# EAGLE design Ultrafin(43)v6_finfix (EAGLE 7.4.0)
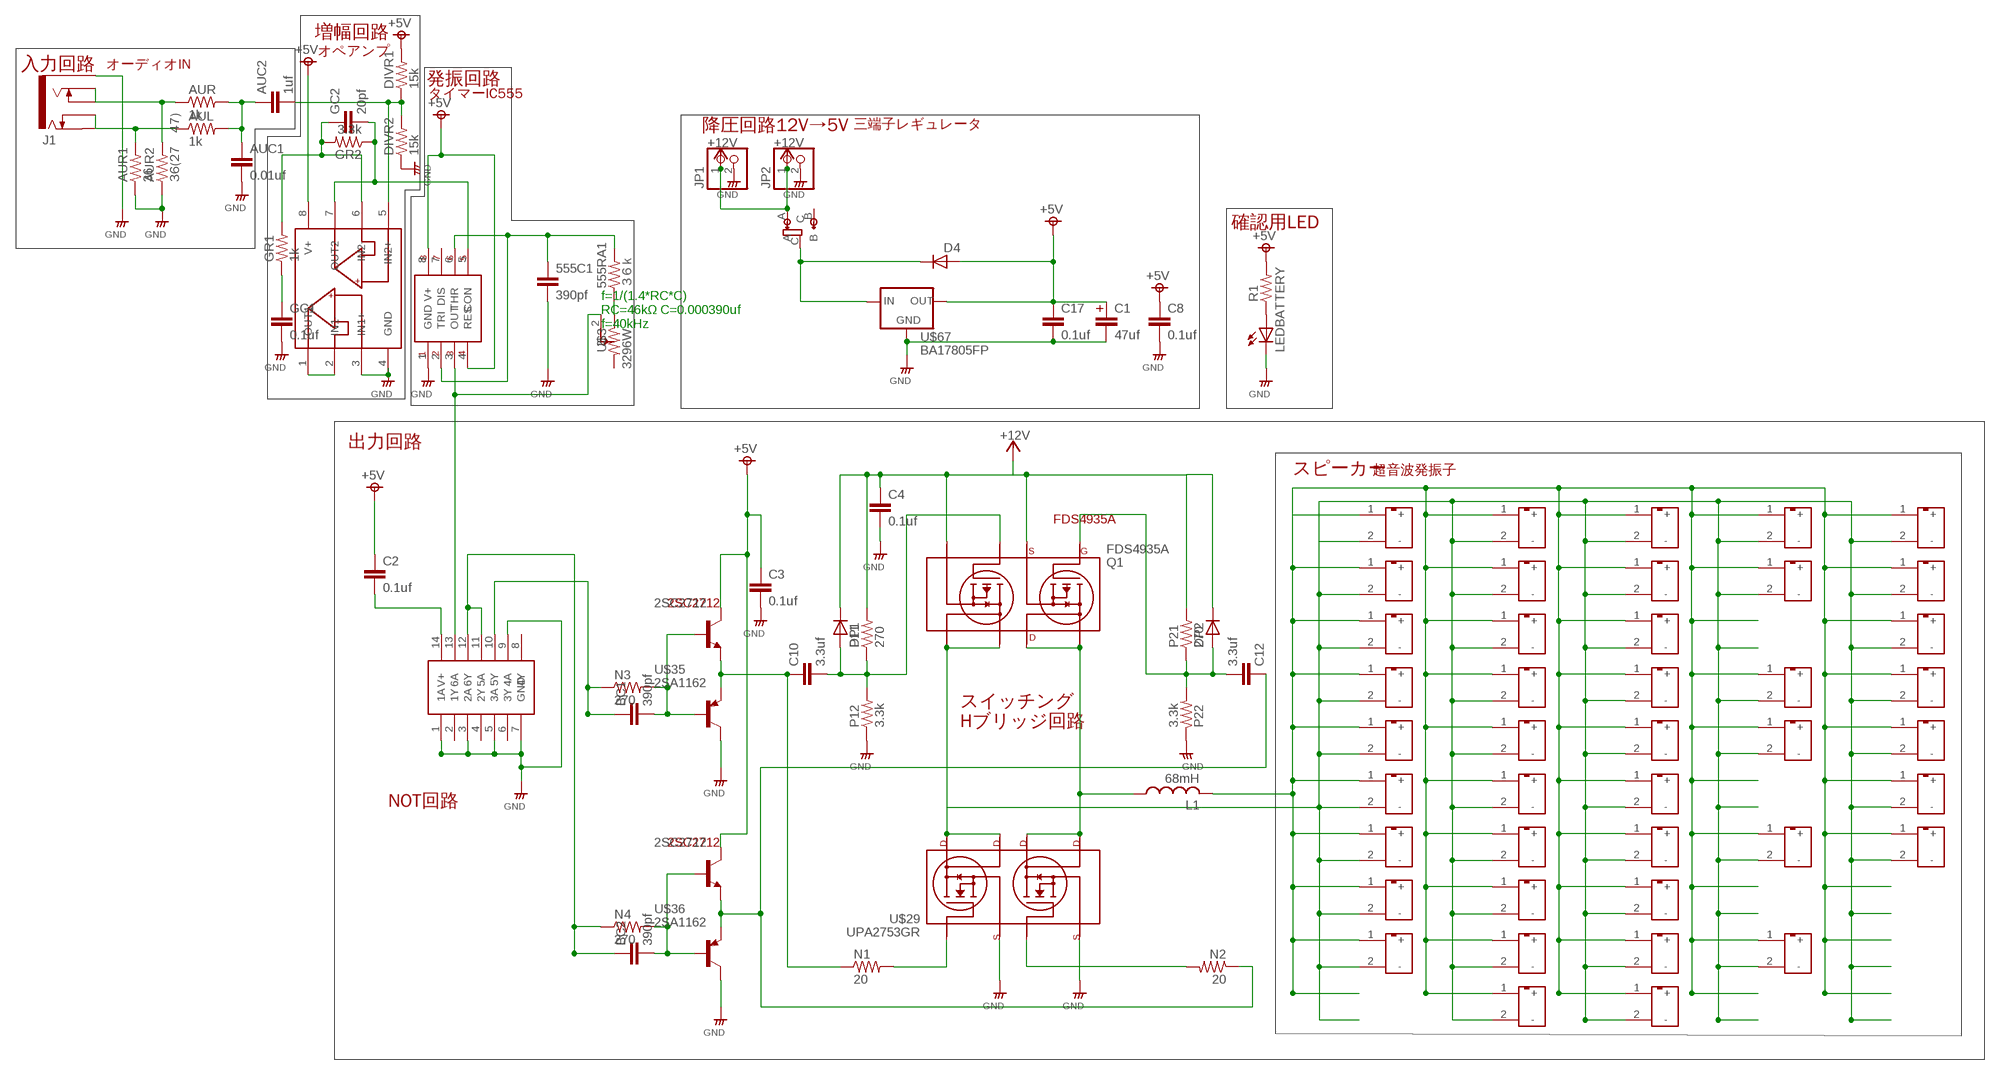
[diagram p0: schematic, sheet 1]

## Parts
555C1  390pf  MLCC  [1608]
555RA1  ３6ｋ  RESISTORS-3  [R_0.3]
AUC1  0.01uf  MLCC  [1608]
AUC2  1uf  MLCC  [1608]
AUL  1k  RESISTORS  [3225]
AUR  1k  RESISTORS  [3225]
AUR1  36  RESISTORS-3  [R_0.3]
AUR2  36(27 47)  RESISTORS1608  [1608]
BC1  390pf  MLCC-3  [MLCC_50]
BC2  390pf  MLCC  [1608]
C1  47uf  CAPACITOR-1U  [C_1U]
C2  0.1uf  MLCC  [1608]
C3  0.1uf  MLCC  [1608]
C4  0.1uf  MLCC  [1608]
C8  0.1uf  MLCC  [1608]
C10  3.3uf  MLCC-3  [MLCC_50]
C12  3.3uf  MLCC-3  [MLCC_50]
C17  0.1uf  MLCC  [1608]
D4  DIODE_JISSO2  [DIODE_JISSO2]
DIVR1  15k  RESISTORS-3  [R_0.3]
DIVR2  15k  RESISTORS-3  [R_0.3]
DP1  DIODE_3  [DIODE_3]
DP2  DIODE_3  [DIODE_3]
GC1  0.1uf  MLCC  [1608]
GC2  20pf  MLCC  [1608]
GR1  1k  RESISTORS  [3225]
GR2  3.3k  RESISTORS-3  [R_0.3]
J1  MJ-352W-C  [MJ-352-M-C]
JP1  PINHD-1X2"  [1*02]
JP2  PINHD-1X2"  [1*02]
L1  68mH  LHL10NB104J  [LHL10NB104J]
LEDBATTERY  LED3MM  [LED3MM]
N1  20  RESISTORS1608  [1608]
N2  20  RESISTORS-3  [R_0.3]
N3  270  RESISTORS1608  [1608]
N4  270  RESISTORS1608  [1608]
P11  270  RESISTORS-3  [R_0.3]
P12  3.3k  RESISTORS-3  [R_0.3]
P21  270  RESISTORS-3  [R_0.3]
P22  3.3k  RESISTORS-3  [R_0.3]
Q1  FDS4935A  [FDS4935A]
R1  RESISTORS3216  [3216]
U$3  3296W  [R_VARIABLE]
U$4  UT1007-Z325R  [UT1007-Z325R]
U$5  ICM7555CD  [SOP8]
U$8  UT1007-Z325R  [UT1007-Z325R]
U$10  UT1007-Z325R  [UT1007-Z325R]
U$11  UT1007-Z325R  [UT1007-Z325R]
U$12  UT1007-Z325R  [UT1007-Z325R]
U$14  74HC04NS  [SOP14]
U$16  BF2904F  [SOP8]
U$18  UT1007-Z325R  [UT1007-Z325R]
U$23  UT1007-Z325R  [UT1007-Z325R]
U$25  UT1007-Z325R  [UT1007-Z325R]
U$27  UT1007-Z325R  [UT1007-Z325R]
U$28  UT1007-Z325R  [UT1007-Z325R]
U$29  UPA2753GR  [UPA2753GR]
U$31  UT1007-Z325R  [UT1007-Z325R]
U$35  2SA1162  [2SA1162]
U$36  2SA1162  [2SA1162]
U$37  2SC2712  [2SC2712]
U$38  2SC2712  [2SC2712]
U$39  UT1007-Z325R  [UT1007-Z325R]
U$40  UT1007-Z325R  [UT1007-Z325R]
U$42  UT1007-Z325R  [UT1007-Z325R]
U$45  UT1007-Z325R  [UT1007-Z325R]
U$46  UT1007-Z325R  [UT1007-Z325R]
U$47  UT1007-Z325R  [UT1007-Z325R]
U$48  UT1007-Z325R  [UT1007-Z325R]
U$49  UT1007-Z325R  [UT1007-Z325R]
U$50  UT1007-Z325R  [UT1007-Z325R]
U$51  UT1007-Z325R  [UT1007-Z325R]
U$52  UT1007-Z325R  [UT1007-Z325R]
U$53  UT1007-Z325R  [UT1007-Z325R]
U$54  UT1007-Z325R  [UT1007-Z325R]
U$55  UT1007-Z325R  [UT1007-Z325R]
U$56  UT1007-Z325R  [UT1007-Z325R]
U$57  UT1007-Z325R  [UT1007-Z325R]
U$58  UT1007-Z325R  [UT1007-Z325R]
U$59  UT1007-Z325R  [UT1007-Z325R]
U$60  UT1007-Z325R  [UT1007-Z325R]
U$61  UT1007-Z325R  [UT1007-Z325R]
U$62  UT1007-Z325R  [UT1007-Z325R]
U$63  UT1007-Z325R  [UT1007-Z325R]
U$64  UT1007-Z325R  [UT1007-Z325R]
U$67  BA17805FP  [BA17805FP]
U$71  UT1007-Z325R  [UT1007-Z325R]
U$74  UT1007-Z325R  [UT1007-Z325R]
U$78  UT1007-Z325R  [UT1007-Z325R]
U$79  UT1007-Z325R  [UT1007-Z325R]
U$80  UT1007-Z325R  [UT1007-Z325R]
U$81  UT1007-Z325R  [UT1007-Z325R]
U$82  UT1007-Z325R  [UT1007-Z325R]
U$83  UT1007-Z325R  [UT1007-Z325R]
U$84  SLIDE_ESD175202  [SLIDE_ESD175202]

## Nets
+5V: C1.P$1 C2.P$1 C3.P$1 C8.P$1 C17.P$1 D4.P$1(A) DIVR1.2 R1.P$6 U$5.4(RES) U$5.8(V+) U$16.8(V+) U$37.C U$38.C U$67.OUTPUT(OUT)
+12V: C4.P$1 DP1.C DP2.C JP1.1 JP2.1 P11.2 P21.2 Q1.1(S2) Q1.3(S1) U$84.A
AGND: 555C1.P$2 AUC1.P$2 AUR1.1 AUR2.P$1 C1.P$2 C8.P$2 C17.P$2 DIVR2.1 GC1.P$2 J1.1 JP1.2 JP2.2 LEDBATTERY.K(C) P12.1 P22.1 U$5.1(GND) U$14.1(1A) U$14.3(2A) U$14.5(3A) U$14.7(GND) U$14.9(4A) U$16.3(IN1+) U$16.4(GND) U$29.1(S1) U$29.3(S2) U$35.C U$36.C U$67.COMMON(GND) ; supply symbol labelled GND
GND: C3.P$2 C4.P$2
N$1: AUR2.P$2 AUR.P$1 J1.2 J1.3
N$2: AUL.P$1 AUR1.2 J1.4 J1.5
N$3: AUC1.P$1 AUC2.P$1 AUL.P$2 AUR.P$2
N$4: C12.1 N2.1 U$36.E U$38.E
N$5: BC2.P$1 N4.P$1 U$14.11(5A) U$14.12(6Y)
N$6: Q1.7(D22) Q1.8(D21) U$4.2(-) U$8.2(-) U$10.2(-) U$11.2(-) U$12.2(-) U$18.2(-) U$23.2(-) U$25.2(-) U$27.2(-) U$28.2(-) U$29.7(D12) U$29.8(D11) U$31.2(-) U$39.2(-) U$40.2(-) U$42.2(-) U$45.2(-) U$46.2(-) U$47.2(-) U$48.2(-) U$49.2(-) U$50.2(-) U$51.2(-) U$52.2(-) U$53.2(-) U$54.2(-) U$55.2(-) U$56.2(-) U$57.2(-) U$58.2(-) U$59.2(-) U$60.2(-) U$61.2(-) U$62.2(-) U$63.2(-) U$64.2(-) U$71.2(-) U$74.2(-) U$78.2(-) U$79.2(-) U$80.2(-) U$81.2(-) U$82.2(-) U$83.2(-)
N$7: 555C1.P$1 555RA1.2 U$5.2(TRI) U$5.6(THR)
N$8: U$3.2 U$5.3(OUT) U$14.13(6A)
N$9: 555RA1.1 U$3.1
N$10: L1.1 Q1.5(D12) Q1.6(D11) U$29.5(D22) U$29.6(D21)
N$11: C10.1 N1.P$1 U$35.E U$37.E
N$12: C10.2 DP1.A P11.1 P12.2 Q1.2(G2)
N$16: BC1.2 N3.P$2 U$35.B U$37.B
N$18: BC2.P$2 N4.P$2 U$36.B U$38.B
N$20: BC1.1 N3.P$1 U$14.10(5Y)
N$21: N1.P$2 U$29.2(G1)
N$22: AUC2.P$2 DIVR1.1 DIVR2.2 U$16.5(IN2+)
N$24: GC2.P$1 GR1.P$2 GR2.2 U$16.6(IN2-)
N$25: GC1.P$1 GR1.P$1
N$26: C12.2 DP2.A P21.1 P22.2 Q1.4(G1)
N$28: N2.2 U$29.4(G2)
N$29: D4.P$2(C) U$67.INPUT(IN) U$84.C
N$30: U$16.1(OUT1) U$16.2(IN1-)
N$39: GC2.P$2 GR2.1 U$5.5(CON) U$16.7(OUT2)
N$40: LEDBATTERY.A R1.P$5
N$41: L1.2 U$4.1(+) U$8.1(+) U$10.1(+) U$11.1(+) U$12.1(+) U$18.1(+) U$23.1(+) U$25.1(+) U$27.1(+) U$28.1(+) U$31.1(+) U$39.1(+) U$40.1(+) U$42.1(+) U$45.1(+) U$46.1(+) U$47.1(+) U$48.1(+) U$49.1(+) U$50.1(+) U$51.1(+) U$52.1(+) U$53.1(+) U$54.1(+) U$55.1(+) U$56.1(+) U$57.1(+) U$58.1(+) U$59.1(+) U$60.1(+) U$61.1(+) U$62.1(+) U$63.1(+) U$64.1(+) U$71.1(+) U$74.1(+) U$78.1(+) U$79.1(+) U$80.1(+) U$81.1(+) U$82.1(+) U$83.1(+)
N$43: C2.P$2 U$14.14(V+)
Unconnected: U$3.3 U$5.7(DIS) U$14.2(1Y) U$14.4(2Y) U$14.6(3Y) U$14.8(4Y) U$84.B

## Notes on the sheet
- 増幅回路
- オペアンプ
- 入力回路 | オーディオIN
- 発振回路
- タイマーIC555
- 降圧回路12V→5V | 三端子レギュレータ
- 確認用LED
- f=1/(1.4*RC*C)
  RC=46kΩ C=0.000390uf
  f=40kHz
- 出力回路
- スピーカー | 超音波発振子
- スイッチング
  Hブリッジ回路
- NOT回路

## Library data of the parts
555C1 AUC1 AUC2 BC1 BC2 C2-C4 C8 C10 C12 C17 GC1 GC2 = rcl__s:MLCC: CAPACITOR, European symbol
555RA1 AUL AUR AUR1 AUR2 DIVR1 DIVR2 GR1 GR2 N1-N4 P11 P12 P21 P22 R1 = rcl__s:RESISTORS
C1 = rcl__s:CAPACITOR
D4 DP1 DP2 = diode_s:DIODE
J1 = demi:MJ-352W-C: MJ-352W-C Marushin 3.5mm Stereo Jack
JP1 JP2 = pinhead_s:PINHD-1X2: PIN HEADER
L1 = Coil:LHL10NB104J
LEDBATTERY = LED_s:LED: LED OSRAM: - CHIPLED LG R971, LG N971, LY N971, LG Q971, LY Q971, LO R971, LY R971 LH N974, LH R974 LS Q976, LO Q976, LY Q976 LO Q996 - Hyper CHIPLED LW Q18S LB Q993, LB Q99A, LB R99A - SideLED LS A670, LO A670, LY A670, LG A670, LP A670 LB A673, LV A673, LT A673, LW A673 LH A674 LY A675 LS A676, LA A676, LO A676, LY A676, LW A676 LS A679, LY A679, LG A679 - Hyper Micro SIDELED® LS Y876, LA Y876, LO Y876, LY Y876 LT Y87S - SmartLED LW L88C, LW L88S LB L89C, LB L89S, LG L890 LS L89K, LO L89K, LY L89K LS L896, LA L896, LO L896, LY L896 - TOPLED LS T670, LO T670, LY T670, LG T670, LP T670 LSG T670, LSP T670, LSY T670, LOP T670, LYG T670 LG T671, LOG T671, LSG T671 LB T673, LV T673, LT T673, LW T673 LH T674 LS T676, LA T676, LO T676, LY T676, LB T676, LH T676, LSB T676, LW T676 LB T67C, LV T67C, LT T67C, LS T67K, LO T67K, LY T67K, LW E67C LS E67B, LA E67B, LO E67B, LY E67B, LB E67C, LV E67C, LT E67C LW T67C LS T679, LY T679, LG T679 LS T770, LO T770, LY T770, LG T770, LP T770 LB T773, LV T773, LT T773, LW T773 LH T774 LS E675, LA E675, LY E675, LS T675 LS T776, LA T776, LO T776, LY T776, LB T776 LHGB T686 LT T68C, LB T68C - Hyper Mini TOPLED® LB M676 - Mini TOPLED Santana® LG M470 LS M47K, LO M47K, LY M47K Source: http://www.osram.convergy.de - LUMILED® LXK2-PW12-R00, LXK2-PW12-S00, LXK2-PW14-U00, LXK2-PW14-V00 LXK2-PM12-R00, LXK2-PM12-S00, LXK2-PM14-U00 LXK2-PE12-Q00, LXK2-PE12-R00, LXK2-PE12-S00, LXK2-PE14-T00, LXK2-PE14-U00 LXK2-PB12-K00, LXK2-PB12-L00, LXK2-PB12-M00, LXK2-PB14-N00, LXK2-PB14-P00, LXK2-PB14-Q00 LXK2-PR12-L00, LXK2-PR12-M00, LXK2-PR14-Q00, LXK2-PR14-R00 LXK2-PD12-Q00, LXK2-PD12-R00, LXK2-PD12-S00 LXK2-PH12-R00, LXK2-PH12-S00 LXK2-PL12-P00, LXK2-PL12-Q00, LXK2-PL12-R00 Source: www.luxeon.com
Q1 = FET_s:FDS4935A
U$3 = rcl__s:3296W
U$4 U$8 U$10-U$12 U$18 U$23 U$25 U$27 U$28 U$31 U$39 U$40 U$42 U$45-U$64 U$71 U$74 U$78-U$83 = UT1007-Z325R:UT1007-Z325R
U$5 = LMC555:ICM7555CD
U$14 = 74HCserias:74HC04NS
U$16 = OP_s:BF2904F
U$29 = FET_s:UPA2753GR
U$35 U$36 = demi:2SA1162
U$37 U$38 = demi:2SC2712
U$67 = regulator_s:BA17805FP
U$84 = switch_s:SLIDE_ESD175202

## Board
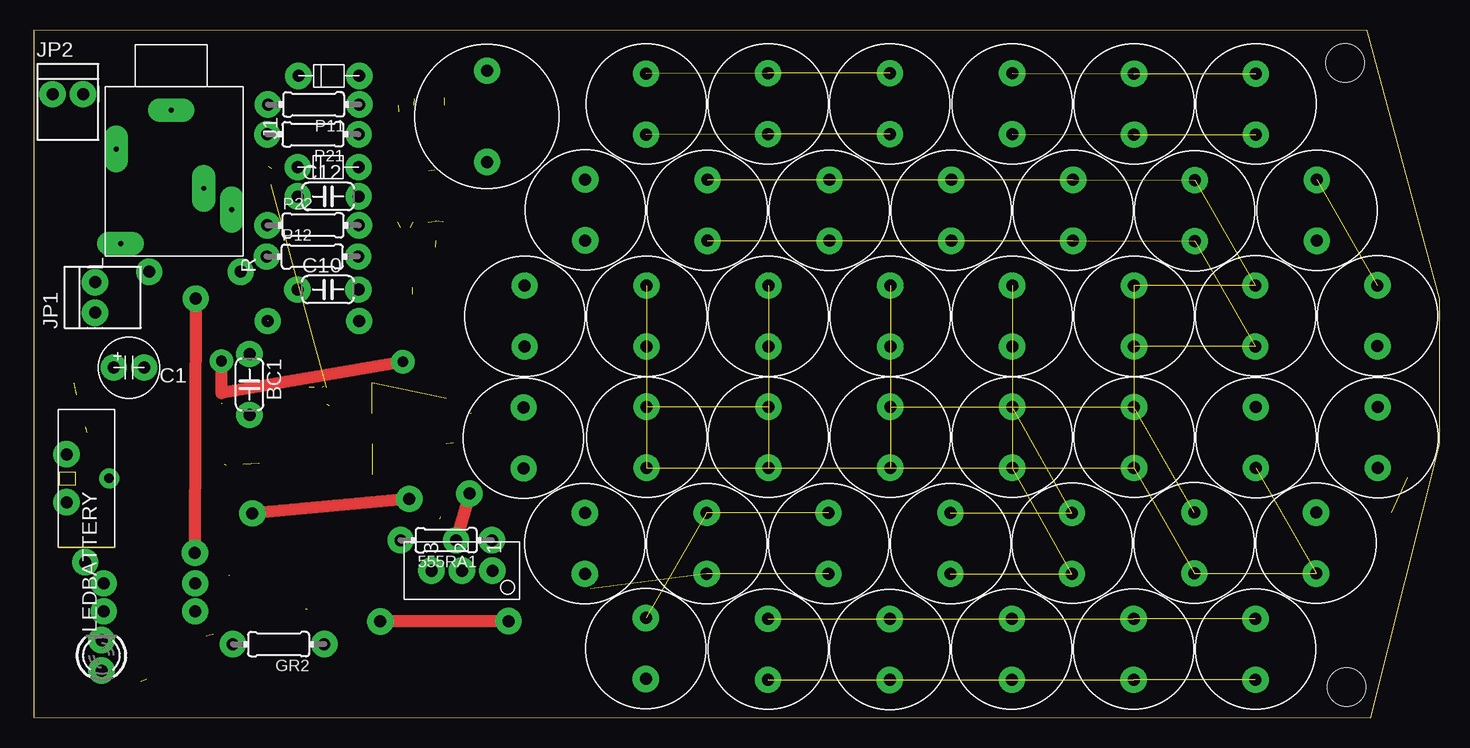
[diagram p1: board, top side]
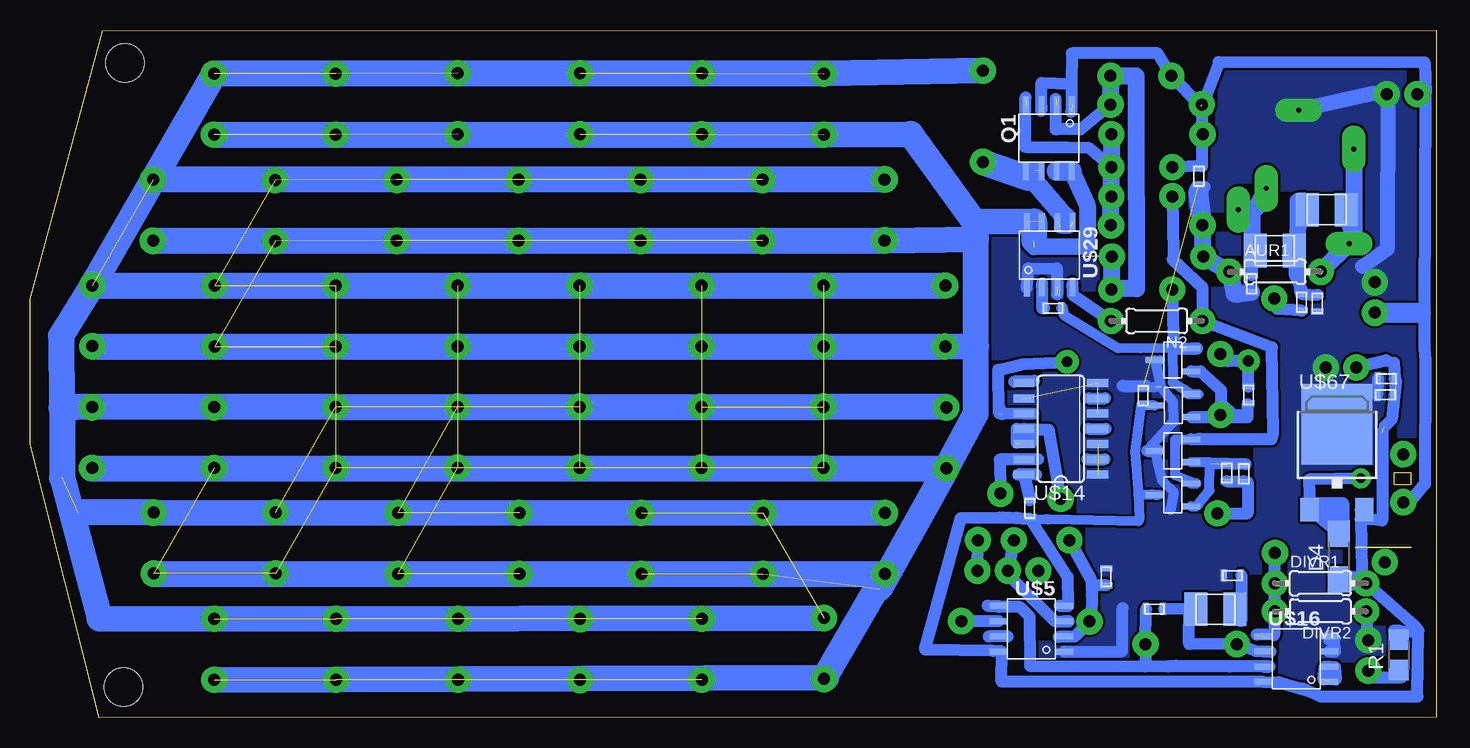
[diagram p2: board, bottom side, seen from below]

Size 117.24 x 57.36 mm. Coordinates in mm from the lower left corner, seen from the top.
Outline: 0,0.03 111.47,0 117.24,22.83 117.22,34.94 111.17,57.31 0,57.36 0,0.03
Copper layers (1*16): Top 0.035mm / dielectric 1.5mm / Bottom 0.035mm
Design rules "default": minimum track width 10mil, minimum drill 24mil, track to track 8mil, track to pad 8mil, pad to pad 8mil, via to via 8mil, smd to smd 8mil, copper to edge 40mil, drill to drill 8mil, minimum pad ring 10mil, minimum via ring 8mil, stop-mask expansion 4mil, vias tented up to drill 0mil, thermal gap 10mil
Holes 3.2 mm at 109.46,2.57 109.33,54.61

### Footprints (pad centres in the part's own frame; a part is rotated, then mirrored left to right if it is on the bottom)
1608 = smd 0.5 x 1: P$1 -0.7,0; P$2 0.7,0
R_0.3 = drill 1 pad 2.184: 1 -3.81,0; 2 3.81,0; 3 -3.81,0
3225 = smd 1.9 x 2.8: P$1 -1.27,0.02; P$2 1.98,0.02
MLCC_50 = drill 1 pad 2.184: 1 -2.54,0; 2 2.54,0
C_1U = drill 1 pad 2.184: P$1 -1.27,0; P$2 1.27,0
DIODE_JISSO2 = smd 2.184 x 1.829: P$1 -1.905,0; P$2 1.905,0
DIODE_3 = drill 1 pad 2.184: A -2.54,0; C 2.54,0
MJ-352-M-C = drill 0.4 pad 1.95 long: 1 -4.655,-1.99; 2 3.645,3.05; 3 1.875,0.72; 4 6.475,-6.2; 5 -1.405,-6.58
1*02 = drill 1 pad 2.184: 1 -1.27,0; 2 1.27,0
LHL10NB104J = drill 1 pad 2.184: 1 0,3.81; 2 0,-3.81
LED3MM = drill 1 pad 2.184: A -1.27,0; K 1.27,0
FDS4935A = smd 1.5 x 0.5: 1 -2.74,1.905; 2 -2.74,0.635; 3 -2.74,-0.635; 4 -2.74,-1.905; 5 2.74,-1.905; 6 2.74,-0.635; 7 2.74,0.635; 8 2.74,1.905
3216 = smd 1.676 x 1.676: P$5 0,0; P$6 2.54,0
R_VARIABLE = drill 1 pad 2.184: 1 0.019,-2.578; 2 0.019,-0.037; 3 0.019,2.502
UT1007-Z325R = drill 1 pad 2.184: 1 0,2.54; 2 0,-2.54
SOP8 = smd 1.5 x 0.5: 1 -2.74,1.905; 2 -2.74,0.635; 3 -2.74,-0.635; 4 -2.74,-1.905; 5 2.74,-1.905; 6 2.74,-0.635; 7 2.74,0.635; 8 2.74,1.905
SOP14 = smd 0.66 x 1.778: 1 -3.81,-3.073; 2 -2.54,-3.073; 3 -1.27,-3.073; 4 0,-3.073; 5 1.27,-3.073; 6 2.54,-3.073; 7 3.81,-3.073; 8 3.81,3.073; 9 2.54,3.073; 10 1.27,3.073; 11 0,3.073; 12 -1.27,3.073; 13 -2.54,3.073; 14 -3.81,3.073
UPA2753GR = smd 1.5 x 0.5: 1 -2.74,1.905; 2 -2.74,0.635; 3 -2.74,-0.635; 4 -2.74,-1.905; 5 2.74,-1.905; 6 2.74,-0.635; 7 2.74,0.635; 8 2.74,1.905
2SA1162 = smd 1.524 x 0.508: B -1.459,0.767; C 1.594,-0.182; E -1.459,-1.133
2SC2712 = smd 1.524 x 0.508: B -1.696,0.95; C 1.356,0; E -1.696,-0.95
BA17805FP = smd 5.908 x 6.708: COMMON 0,1.547 | smd 1.508 x 1.93: INPUT -2.28,-5.594; OUTPUT 2.28,-5.594
SLIDE_ESD175202 = drill 1 pad 2.184: A -0.031,-7.735; B -0.031,-3.735; S2 1.531,-12.735 | drill 0.8 pad 1.676: C 3.519,-5.747

### Placement (x,y rotation side)
555C1  27.53,11.75 90 bottom
555RA1  34.4,14.81 180 top
AUC1  9.92,34.58 270 bottom
AUC2  11.22,34.66 270 bottom
AUL  8.78,42.39 180 bottom
AUR  13.83,38.94 0 bottom
AUR1  13.45,37.2 0 bottom
AUR2  15.4,36.2 90 bottom
BC1  18,27.8 270 top
BC2  17.47,20.42 90 bottom
C1  7.95,29.21 0 top
C2  33.89,17.46 90 bottom
C3  24.43,26.86 90 bottom
C4  19.8,45.15 270 bottom
C8  4.18,28.29 180 bottom
C10  24.54,35.72 0 top
C12  24.56,43.48 0 top
C17  4.24,26.94 180 bottom
D4  8.14,13.46 90 bottom
DIVR1  9.67,11.22 0 bottom
DIVR2  9.67,8.87 180 bottom
DP1  24.62,53.53 180 top
DP2  24.56,45.93 180 top
GC1  17,11.87 180 bottom
GC2  23.51,9.08 180 bottom
GR1  18.08,9.08 180 bottom
GR2  20.43,6.14 180 top
J1  13.46,46.02 270 top
JP1  5.13,35.05 90 top
JP2  2.86,52.01 0 top
L1  37.8,50.16 180 top
LEDBATTERY  5.67,5.21 90 top
N1  31.98,34.15 180 bottom
N2  23.32,33.1 180 bottom
N3  15.67,26.92 270 bottom
N4  16.05,20.35 90 bottom
P11  23.35,51.15 180 top
P12  23.24,38.47 0 top
P21  23.29,48.66 180 top
P22  23.3,41.07 0 top
Q1  32.31,48.34 270 bottom
R1  3.14,3.98 90 bottom
U$3  35.67,12.26 90 top
U$4  91.74,33.5 0 top
U$5  33.77,7.41 180 bottom
U$8  101.9,51.18 0 top
U$10  91.74,51.18 0 top
U$11  81.58,51.21 0 top
U$12  71.39,51.21 0 top
U$14  31.31,24.1 90 bottom
U$16  11.67,4.91 180 bottom
U$18  61.23,51.21 0 top
U$23  51.07,51.18 0 top
U$25  86.66,42.32 0 top
U$27  91.74,23.38 0 top
U$28  86.57,14.56 0 top
U$29  32.24,38.61 90 bottom
U$31  71.37,5.7 0 top
U$35  21.89,29.65 180 bottom
U$36  21.89,22.08 180 bottom
U$37  22.11,26.04 180 bottom
U$38  22.13,18.59 180 bottom
U$39  96.81,42.29 0 top
U$40  61.23,5.71 0 top
U$42  45.99,42.35 0 top
U$45  96.76,14.59 0 top
U$46  81.55,5.71 0 top
U$47  91.71,5.71 0 top
U$48  101.87,5.71 0 top
U$49  101.9,23.37 0 top
U$50  76.44,14.54 0 top
U$51  66.28,14.54 0 top
U$52  56.12,14.54 0 top
U$53  45.96,14.54 0 top
U$54  40.85,23.34 0 top
U$55  61.26,33.5 0 top
U$56  71.42,33.5 0 top
U$57  81.58,33.5 0 top
U$58  51.1,23.4 0 top
U$59  40.94,33.5 0 top
U$60  51.1,33.5 0 top
U$61  61.26,23.4 0 top
U$62  71.42,23.4 0 top
U$63  81.58,23.4 0 top
U$64  76.5,42.32 0 top
U$67  8.29,22.96 0 bottom
U$71  101.85,33.51 0 top
U$74  51.04,5.78 0 top
U$78  66.34,42.32 0 top
U$79  56.18,42.32 0 top
U$80  106.98,42.32 0 top
U$81  112.06,23.37 0 top
U$82  106.92,14.57 0 top
U$83  112.03,33.53 0 top
U$84  2.78,25.72 0 top

### Tracks (layer width: path | path; a pad name or v marks a point on that pad's centre or on a via)
+5V  (4 unrouted)
  Bottom 0.813: U$37.C 24.62,26.07 25.13,22.19 24.86,18.63 | U$38.C 23.13,18.59 23.13,18.61 24.86,18.63 | 24.86,18.63 23.71,18.64 24.84,18.58 24.75,16.61 24.81,16.51 24.81,16.38 32.37,16.54 32.4,16.55 32.51,16.55 33.53,16.52
  Bottom 1.016: 4.49,23.81 4.52,16.45 6.3,16.57 | 33.53,16.52 36.19,16.71 | 36.19,16.71 35.05,16.68 39.64,16.64 42.62,5.68 36.96,5.57 36.22,5.55 | U$5.8 36.22,5.55 | 36.22,5.55 36.24,3.02 14.88,3.02 U$16.8 13.1,2.98 10.81,2.29 | 10.81,2.29 11.19,2.45 | U$5.4 31.42,9.35 31.04,9.34 30.69,9.34 30.69,9.37 30.72,11.8 30.75,11.78 33.86,16.59 36.43,16.71 36.19,16.71 | 10.81,2.29 9.64,1.78 1.57,1.78 1.51,7.18 | 5.88,11.16 DIVR1.2 | 1.51,7.18 1.48,7.27 1.79,7.65 DIVR1.2 | R1.P$6 3.1,7.27 3.51,7.27 1.51,7.18 | 4.33,24.26 3.73,24.86 3.38,28.01 3.35,27.94 3.37,28.1 C8.P$1 3.54,29.59 4.18,29.81 C1.P$1 | U$67.OUTPUT 6.3,17.36 6.3,16.57 | 6.3,16.57 6.21,12.16 DIVR1.2 | 6.14,11.37 DIVR1.2
  Bottom 1.676: D4.P$1 6.14,11.37
+12V  (3 unrouted)
  Bottom 1.016: 2.75,18.1 U$84.A 2.21,17.98 0.95,19.49 0.94,19.49 0.97,19.53 0.91,29.5 | 30.42,52.89 30.4,55.4 23.23,55.4 DP1.C 19.57,51.02 19.57,50.99 19.42,51.25 18.15,54.64 18.15,54.67 0.97,54.64 0.87,52.13 | 30.42,52.89 30.43,50.55 | Q1.3 32.94,50.61 32.91,52.96 30.42,52.89 | 0.96,33.77 0.97,30.61 0.91,29.5 | 0.96,33.77 0.87,52.13 | DP2.C 19.54,45.99 P11.2 19.54,49.15 19.48,49.09 P21.2 | 0.94,30.13 0.91,29.5 | 0.87,52.13 JP2.1 | JP1.1 0.96,33.77
AGND  (6 unrouted)
  Bottom 0.813: 23.03,29.81 U$35.C 22.97,27.59 21.96,26.32 21.92,24.67 24.02,22.38 U$36.C 22.88,19.78 21.89,18.86 22.18,17.3 | 24.05,27.59 23.38,27.59
  Bottom 1.016: U$5.1 26.18,5.56 26.16,9.14 | LEDBATTERY.K DIVR2.1 | C8.P$2 C17.P$2 | U$16.3 8.46,5.54 8.46,5.81 8.49,5.81 8.49,6.54 8.93,6.54 U$16.4 | 26.15,27.69 24.21,27.69 | 19.8,42.86 19.83,42.86 19.83,43.94 19.83,44.26 19.32,44.26 | U$29.1 34.02,37.47 31.64,37.5 31.61,35.34
  Bottom 1.27: J1.1 5.13,52.07 4.05,52.01 4.11,39.08 6.14,37.64
  Bottom 1.422: P22.1 P12.1 AUR1.1 16.84,35.37 16.65,35.34 AUR2.P$1
  Bottom 1.676: P22.1 19.83,43.94
  pour Bottom (rank 6, no thermals): 0.3,56.45 0.49,0.76 110.63,0.76 116.47,24.07 116.47,34.23 110.51,56.64
GND  (1 unrouted)
N$1
  Bottom 1.016: AUR2.P$2 15.32,37.94 15.32,37.97 AUR.P$1
  Bottom 1.27: J1.2 15.32,42.42
  Bottom 1.422: AUR.P$1 15.35,39.75 15.35,42.39 15.1,42.39 | 15.1,42.39 J1.2 | J1.3 15.1,42.39
N$2
  Bottom 1.422: J1.5 6.87,39.91 | 6.87,39.91 J1.4 AUR1.2 | 6.87,39.91 AUL.P$1
N$3
  Bottom 1.016: 11.86,38.29 11.83,36.99 11.26,35.72 AUC2.P$1 AUC1.P$1
  Bottom 1.422: AUL.P$2 10.94,43.09 11.54,43.09 11.6,38.32 12.14,38.29 11.86,38.29 11.86,38.99 AUR.P$2
N$4  (1 unrouted)
  Bottom 0.813: U$38.E 20.43,19.56 20.02,19.56 20.02,19.53 21.77,20.23 21.77,23.21 U$36.E
  Bottom 1.016: C12.1 21.92,38.67 21.99,38.23 19.53,35.94 N2.1 | U$36.E 19.54,23.24 19.76,23.27 13.73,23.25 13.61,23.78 13.7,30.89 19.54,33.08
N$5  (via drill 1 pad 2.18)  (1 unrouted)
  Top 1.016: v31.32,18.26 v18.24,17.05
  Bottom 1.016: U$14.11 33.54,24.07 | 33.54,24.07 35,24.1 35,22.92 | 33.54,24.07 32.34,24.04 v31.32,18.26 | v18.24,17.05 15.73,17.05 15.73,19.65 N4.P$1 16.05,19.72 BC2.P$1
N$6  (33 unrouted)
  Bottom 1.422: Q1.8 29.1,42.77 29.1,39.31 33.51,39.27
  Bottom 1.676: Q1.8 Q1.7
  Bottom 2.184: U$48.2 50.85,3.37 U$74.2 U$53.2 | U$54.2 46.43,10.76 U$53.2 | U$54.2 38.4,25.37 38.37,30.99 | 38.37,30.99 U$59.2 112.03,30.96 U$83.2 | 38.37,30.99 38.37,39.94 | 38.37,39.94 38.53,41.37 | 38.53,41.37 33.51,41.4 33.54,39.81 | 38.37,39.94 U$42.2 106.98,39.81 U$80.2 | 38.53,41.37 43.83,48.67 U$23.2 U$8.2 | U$81.2 112.06,20.8 U$54.2 | U$82.2 106.92,12 U$53.2
N$7  (via drill 1 pad 2.18)
  Top 1.016: v39.61,8.07 v28.91,8.03
  Bottom 1.016: 555RA1.2 30.62,14.88 28.77,11.46 28.75,10.96 | U$5.6 v39.61,8.07 | U$5.2 31.48,6.73 31.42,6.79 30.15,6.79 v28.91,8.03 28.75,8.29 28.72,10.26 28.75,10.96 | 555C1.P$1 28.75,11.05 28.75,10.96
N$8  (via drill 1 pad 2.18)
  Top 1.016: v36.34,18.7 v35.23,14.8
  Bottom 1.016: U$14.13 36.4,21.53 v36.34,18.7 | v35.23,14.8 U$3.2 35.71,11.98 31.78,8.05 30.67,8.05 30.66,8.03 U$5.3
N$9
  Bottom 1.016: U$3.1 555RA1.1
N$10  (3 unrouted)
  Bottom 1.016: 31.29,40.89 30.56,40.89 30.56,41.91 30.95,41.77 31.39,41.97 31.39,40.89 30.88,41.34
  Bottom 1.422: 33.64,44.86 33.45,45.66 Q1.5
  Bottom 1.676: 33.64,44.86 30.95,41.77
  Bottom 1.93: 36.24,45.91 34.04,45.05 33.64,44.86
  Bottom 2.184: L1.1 34.04,45.05
N$11
  Bottom 0.813: U$35.E 22.02,30.83 | U$37.E 21.99,27.97 22.02,30.83 | N1.P$1 31.16,34.22 31.07,33.59 26.53,30.83 24.66,30.82 22.02,30.83
  Bottom 1.016: C10.1 22.04,35.76 21.89,30.8 19.96,30.8 19.96,30.79 U$35.E
N$12  (1 unrouted)
  Bottom 0.406: 27.08,35.78 C10.2 27.05,35.72
  Bottom 1.016: DP1.A 27.26,53.53 | P11.1 29.64,49.09 31.64,49.09 31.73,49.05 31.73,51.63 | 25.04,43.37 25,43.37
  Bottom 1.422: 25.04,43.37 25.04,53.53 DP1.A P11.1 | 25,43.37 25,35.78 27.08,35.78 | 27.05,35.72 P12.2
N$15
  Bottom 1.016: 11.38,37.97 11.38,35.53
N$16  (1 unrouted)
  Bottom 1.016: U$35.B 19.66,28.89 17.95,27.34 17.95,26.23 | 17.95,26.23 17.95,25.3 BC1.2 | U$37.B 15.73,25.09 15.73,25.26 | 17.95,26.23 16.99,25.26 15.73,25.26 | 15.73,25.26 15.73,26.16
N$17
  Bottom 1.016: 33.7,22.99 34.85,22.99 34.88,23.02 34.56,23.02 34.05,23.53 33.73,23.53 33.7,23.56
N$18  (2 unrouted)
  Bottom 0.813: 18.79,21.21 18.88,21.3 | U$38.B 19.97,17.64 19.83,17.78 18.91,18.95 18.88,21.3 | 18.88,21.3 U$36.B
  Bottom 1.016: 15.9,21.15 18.79,21.21
N$19
  Bottom 1.016: 33.35,20.29 34.88,20.29
N$20  (via drill 0.9 pad 1.93)  (1 unrouted)
  Top 1.016: v30.78,29.69 15.67,27.08 v15.67,29.75
  Bottom 1.016: 33.61,25.37 U$14.10 36.21,25.34 | 36.37,25.72 36.47,25.4 36.53,29.02 34.46,29.5 v30.78,29.69 | v15.67,29.75 17.42,29.75 BC1.1 | 15.73,29.69 v15.67,29.75 | N3.P$1 v15.67,29.75
N$21
  Bottom 1.016: 32.88,36.23 U$29.2 32.88,34.29 32.86,34.13 N1.P$2
N$22  (via drill 1 pad 2.18)  (1 unrouted)
  Top 1.016: v13.51,34.96 v13.45,13.75
  Bottom 1.016: 13.41,35.02 v13.51,34.96 13.29,34.1 AUC2.P$2 | 14.97,6.95 13.51,6.92 DIVR2.2 DIVR1.1 v13.45,13.75
N$24  (1 unrouted)
  Bottom 1.016: U$16.6 13.83,5.52 15.03,5.56 GR2.2 20.49,6.19 20.62,6.16 20.59,9.46 GR1.P$2 22.69,9.08
N$25  (1 unrouted)
  Bottom 1.016: 16.27,11.91 16.24,10.07 16.27,8.07 GR1.P$1
N$26  (1 unrouted)
  Bottom 1.016: 34.24,51.72 34.27,47.59 34.05,47.56 30.78,47.56 28.91,47.5 DP2.A | P22.2 27.1,41.07 C12.2
  Bottom 1.422: P22.2 DP2.A P21.1
N$28
  Bottom 1.016: 30.34,36.23 U$29.4 30.34,35.31 N2.2
N$29
  Bottom 1.016: U$67.INPUT 8.57,16.43 | U$84.C 10.62,19.88 U$67.INPUT | D4.P$2 U$67.INPUT
  Bottom 1.27: 8.33,15.14 D4.P$2
N$30  (1 unrouted)
  Bottom 1.016: U$16.2 8.46,4.25 8.4,3.18 9.41,3.21 9.29,4.29
N$31
  Bottom 1.016: 33.2,21.56 34.75,21.56
N$32
  Bottom 0.813: 20.67,27 20.67,26.99 19.83,26.99
N$33
  Bottom 1.016: 33.51,28.1 35.2,28.04
N$34
  Bottom 1.016: 24.1,22.26 23.15,22.26
N$35
  Bottom 1.016: 28.97,26.64 27.61,26.64
N$37
  Bottom 1.016: 28.97,24.1 27.58,24.1
N$38
  Bottom 1.016: 29.1,21.56 27.67,21.56
N$39
  Bottom 1.016: U$16.7 13.89,4.27 13.89,4.29 17.26,4.29 22.37,4.3 | 22.37,4.3 24.27,4.27 | 24.27,4.27 33.86,4.32 33.88,8.4 34.72,9.24 36.43,9.24 U$5.5 37.42,9.34 | 21.7,4.35 22.37,4.3 | 24.27,4.27 GR2.1 GC2.P$2
N$40
  Bottom 1.016: LEDBATTERY.A 5.57,3.4 2.84,3.4 R1.P$5
N$41  (29 unrouted)
  Bottom 2.184: L1.2 U$23.1 U$8.1 U$83.1 | U$83.1 114.63,31.88 114.6,25.84 U$81.1 | U$81.1 114.57,25.91 114.57,20.03 111.43,8.29 U$48.1 U$74.1 | U$53.1 U$82.1 113.24,17.11 | U$81.1 U$49.1 91.74,25.91 U$27.1 91.74,25.94 U$58.1 40.91,25.94 U$54.1 | U$42.1 45.99,44.86 U$80.1 | U$83.1 112.03,36.04 U$59.1
N$42
  Bottom 1.016: 35.74,6.79 37.32,6.79
N$43
  Bottom 1.016: U$14.14 C2.P$2
N$44
  Bottom 1.016: 10.53,17.91 7.76,17.91 7.76,16.48 8.08,16.48 9.19,17.59 8.68,17.59 8.49,17.4
N$46
  Bottom 1.676: 5.22,33.78 1.48,33.78 1.44,33.75
N$47
  Bottom 1.676: 1.7,51.94 1.41,51.94 1.38,51.98